# Altium schematic sheet DIGTITAL.SchDoc: DIGITAL
size 420 x 297 mm; Date: March 14; CheckedBy: ThS. Bùi Quốc Bảo; DrawnBy: Nguyễn Gia Huy; Revision: V1.0; SheetNumber: 5; SheetTotal: 11; MasterProject: STM32-PLC; Sub-system: DA1_prj.PrjPcb
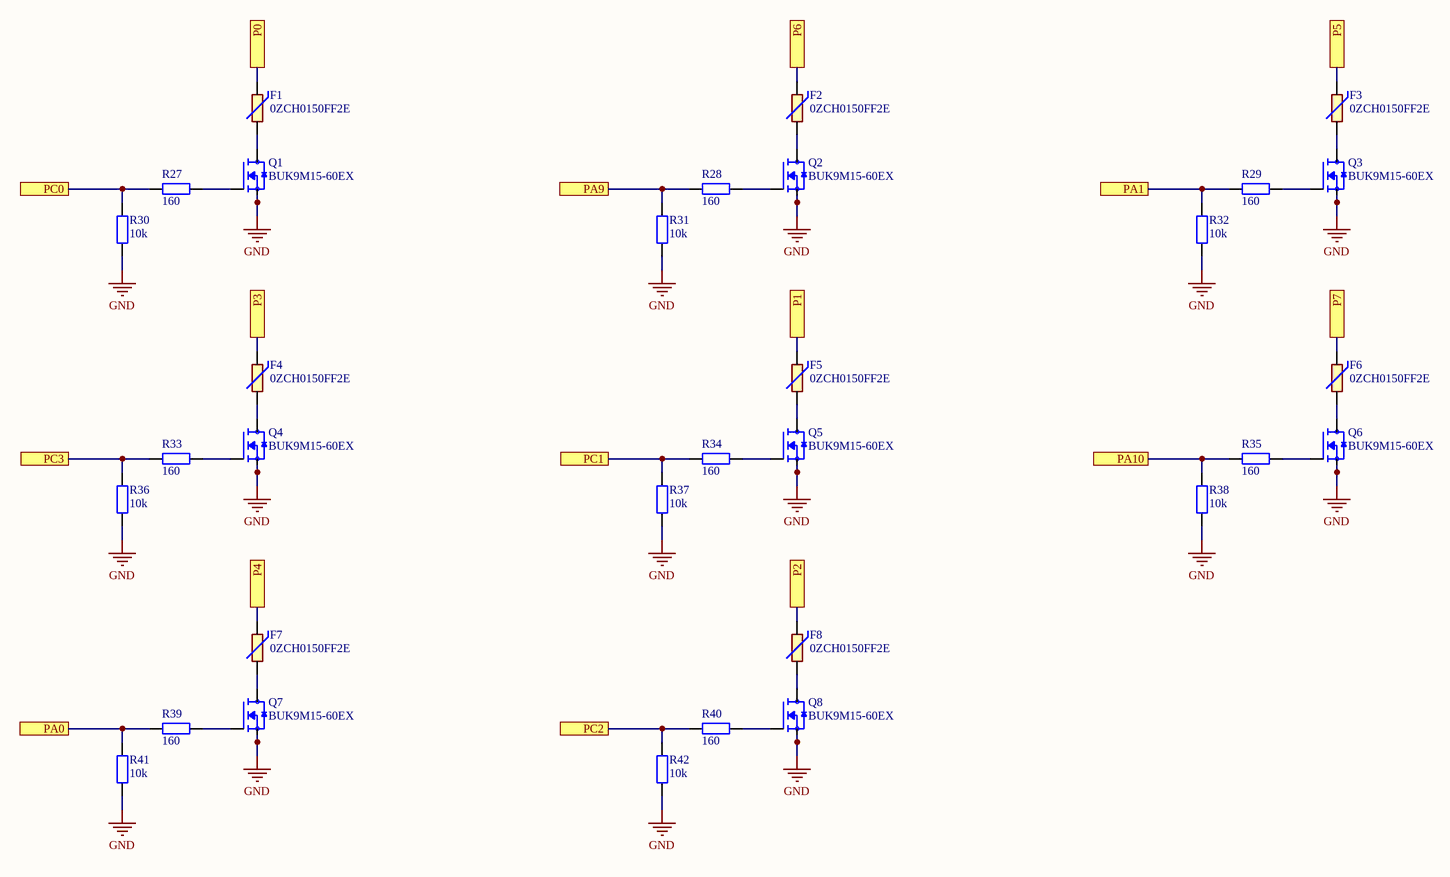
[diagram p0: DIGTITAL.SchDoc]

## Parts
F1  0ZCH0150FF2E  [FUSC3225X90N]
F2  0ZCH0150FF2E  [FUSC3225X90N]
F3  0ZCH0150FF2E  [FUSC3225X90N]
F4  0ZCH0150FF2E  [FUSC3225X90N]
F5  0ZCH0150FF2E  [FUSC3225X90N]
F6  0ZCH0150FF2E  [FUSC3225X90N]
F7  0ZCH0150FF2E  [FUSC3225X90N]
F8  0ZCH0150FF2E  [FUSC3225X90N]
Q1  BUK9M15-60EX  [TRANS_BUK9M15-60EX]
Q2  BUK9M15-60EX  [TRANS_BUK9M15-60EX]
Q3  BUK9M15-60EX  [TRANS_BUK9M15-60EX]
Q4  BUK9M15-60EX  [TRANS_BUK9M15-60EX]
Q5  BUK9M15-60EX  [TRANS_BUK9M15-60EX]
Q6  BUK9M15-60EX  [TRANS_BUK9M15-60EX]
Q7  BUK9M15-60EX  [TRANS_BUK9M15-60EX]
Q8  BUK9M15-60EX  [TRANS_BUK9M15-60EX]
R27  160  [tro smd 0603]
R28  160  [tro smd 0603]
R29  160  [tro smd 0603]
R30  10k  [tro smd 0603]
R31  10k  [tro smd 0603]
R32  10k  [tro smd 0603]
R33  160  [tro smd 0603]
R34  160  [tro smd 0603]
R35  160  [tro smd 0603]
R36  10k  [tro smd 0603]
R37  10k  [tro smd 0603]
R38  10k  [tro smd 0603]
R39  160  [tro smd 0603]
R40  160  [tro smd 0603]
R41  10k  [tro smd 0603]
R42  10k  [tro smd 0603]

## Ports
P0 (see STM32_PLC[2C]), P1 (see STM32_PLC[2C]), P2 (see STM32_PLC[2C]), P3 (see STM32_PLC[2C]), P4 (see STM32_PLC[2C]), P5 (see STM32_PLC[2D]), P6 (see STM32_PLC[2D]), P7 (see STM32_PLC[2D]), PA0 (see STM32_PLC[1B], STM32_PLC[3C]), PA1 (see STM32_PLC[1B], STM32_PLC[3D]), PA9 (see STM32_PLC[1B], STM32_PLC[3D]), PA10 (see STM32_PLC[2B], STM32_PLC[3D]), PC0 (see STM32_PLC[2B], STM32_PLC[3C]), PC1 (see STM32_PLC[2B], STM32_PLC[3C]), PC2 (see STM32_PLC[2B], STM32_PLC[3C]), PC3 (see STM32_PLC[2B], STM32_PLC[3C])

## Nets
GND: Q1.1(S) Q1.2(S) Q1.3(S) Q2.1(S) Q2.2(S) Q2.3(S) Q3.1(S) Q3.2(S) Q3.3(S) Q4.1(S) Q4.2(S) Q4.3(S) Q5.1(S) Q5.2(S) Q5.3(S) Q6.1(S) Q6.2(S) Q6.3(S) Q7.1(S) Q7.2(S) Q7.3(S) Q8.1(S) Q8.2(S) Q8.3(S) R30.1 R31.1 R32.1 R36.1 R37.1 R38.1 R41.1 R42.1
P0: F1.1 ; port P0
P1: F5.1 ; port P1
P2: F8.1 ; port P2
P3: F4.1 ; port P3
P4: F7.1 ; port P4
P5: F3.1 ; port P5
P6: F2.1 ; port P6
P7: F6.1 ; port P7
PA0: R39.1 R41.2 ; port PA0
PA1: R29.1 R32.2 ; port PA1
PA9: R28.1 R31.2 ; port PA9
PA10: R35.1 R38.2 ; port PA10
PC0: R27.1 R30.2 ; port PC0
PC1: R34.1 R37.2 ; port PC1
PC2: R40.1 R42.2 ; port PC2
PC3: R33.1 R36.2 ; port PC3
NetF1_2: F1.2 Q1.5(D)
NetF2_2: F2.2 Q2.5(D)
NetF3_2: F3.2 Q3.5(D)
NetF4_2: F4.2 Q4.5(D)
NetF5_2: F5.2 Q5.5(D)
NetF6_2: F6.2 Q6.5(D)
NetF7_2: F7.2 Q7.5(D)
NetF8_2: F8.2 Q8.5(D)
NetQ1_4: Q1.4(G) R27.2
NetQ2_4: Q2.4(G) R28.2
NetQ3_4: Q3.4(G) R29.2
NetQ4_4: Q4.4(G) R33.2
NetQ5_4: Q5.4(G) R34.2
NetQ6_4: Q6.4(G) R35.2
NetQ7_4: Q7.4(G) R39.2
NetQ8_4: Q8.4(G) R40.2

## Notes on the sheet
- Sub-system:
- Project:
- Design by:
- Sheet title:
- Sheet
- of
- Checked by:
- Approved by:
- Doc No:
- Revision:
- Size:
- Dates:
- A3

## Library data of the parts
F1-F8 = 0ZCH0150FF2E: 1210 SMT PPTC | 1.50 Ih | 6V; MF: Bel Fuse; SnapEDA_Link: https://www.snapeda.com/parts/0ZCH0150FF2E/Bel+Circuit+Protection/view-part/?ref=snap; Package: Package; Value: *; MP: 0ZCH0150FF2E; Check_prices: https://www.snapeda.com/parts/0ZCH0150FF2E/Bel+Circuit+Protection/view-part/?ref=eda
Q1-Q8 = BUK9M15-60EX: Bá»™ chuyá»ƒn Ä‘á»•i N-Channel 60 V 47A (Tc) 75W (Tc) gáº¯n bá» máº·t LFPAK33; MF: Nexperia USA; SnapEDA_Link: https://www.snapeda.com/parts/BUK9M15-60EX/Nexperia/view-part/?ref=snap; Package: LFPAK33-8 Nexperia USA Inc.; Value: *; MP: BUK9M15-60EX; Check_prices: https://www.snapeda.com/parts/BUK9M15-60EX/Nexperia/view-part/?ref=eda
R27-R42 = Tro 0603 1% 10k: RES; Chung_Loai: Dán; Don_Vi: Con; So_Chan: 2; Ten_Linh_Kien: Trở 0603 1% 10k; Ma_Hang: MH006333; Kieu_Chan: *